# Altium schematic sheet 2_Battery_Monitoring_And_Switches.SchDoc: Batteries Monitor and Power Switches
size A3; DrawnBy: Sara V. Martínez; Engineer: Flight; DocumentNumber: 5; Revision: V0.1; SheetNumber: 5; SheetTotal: 11
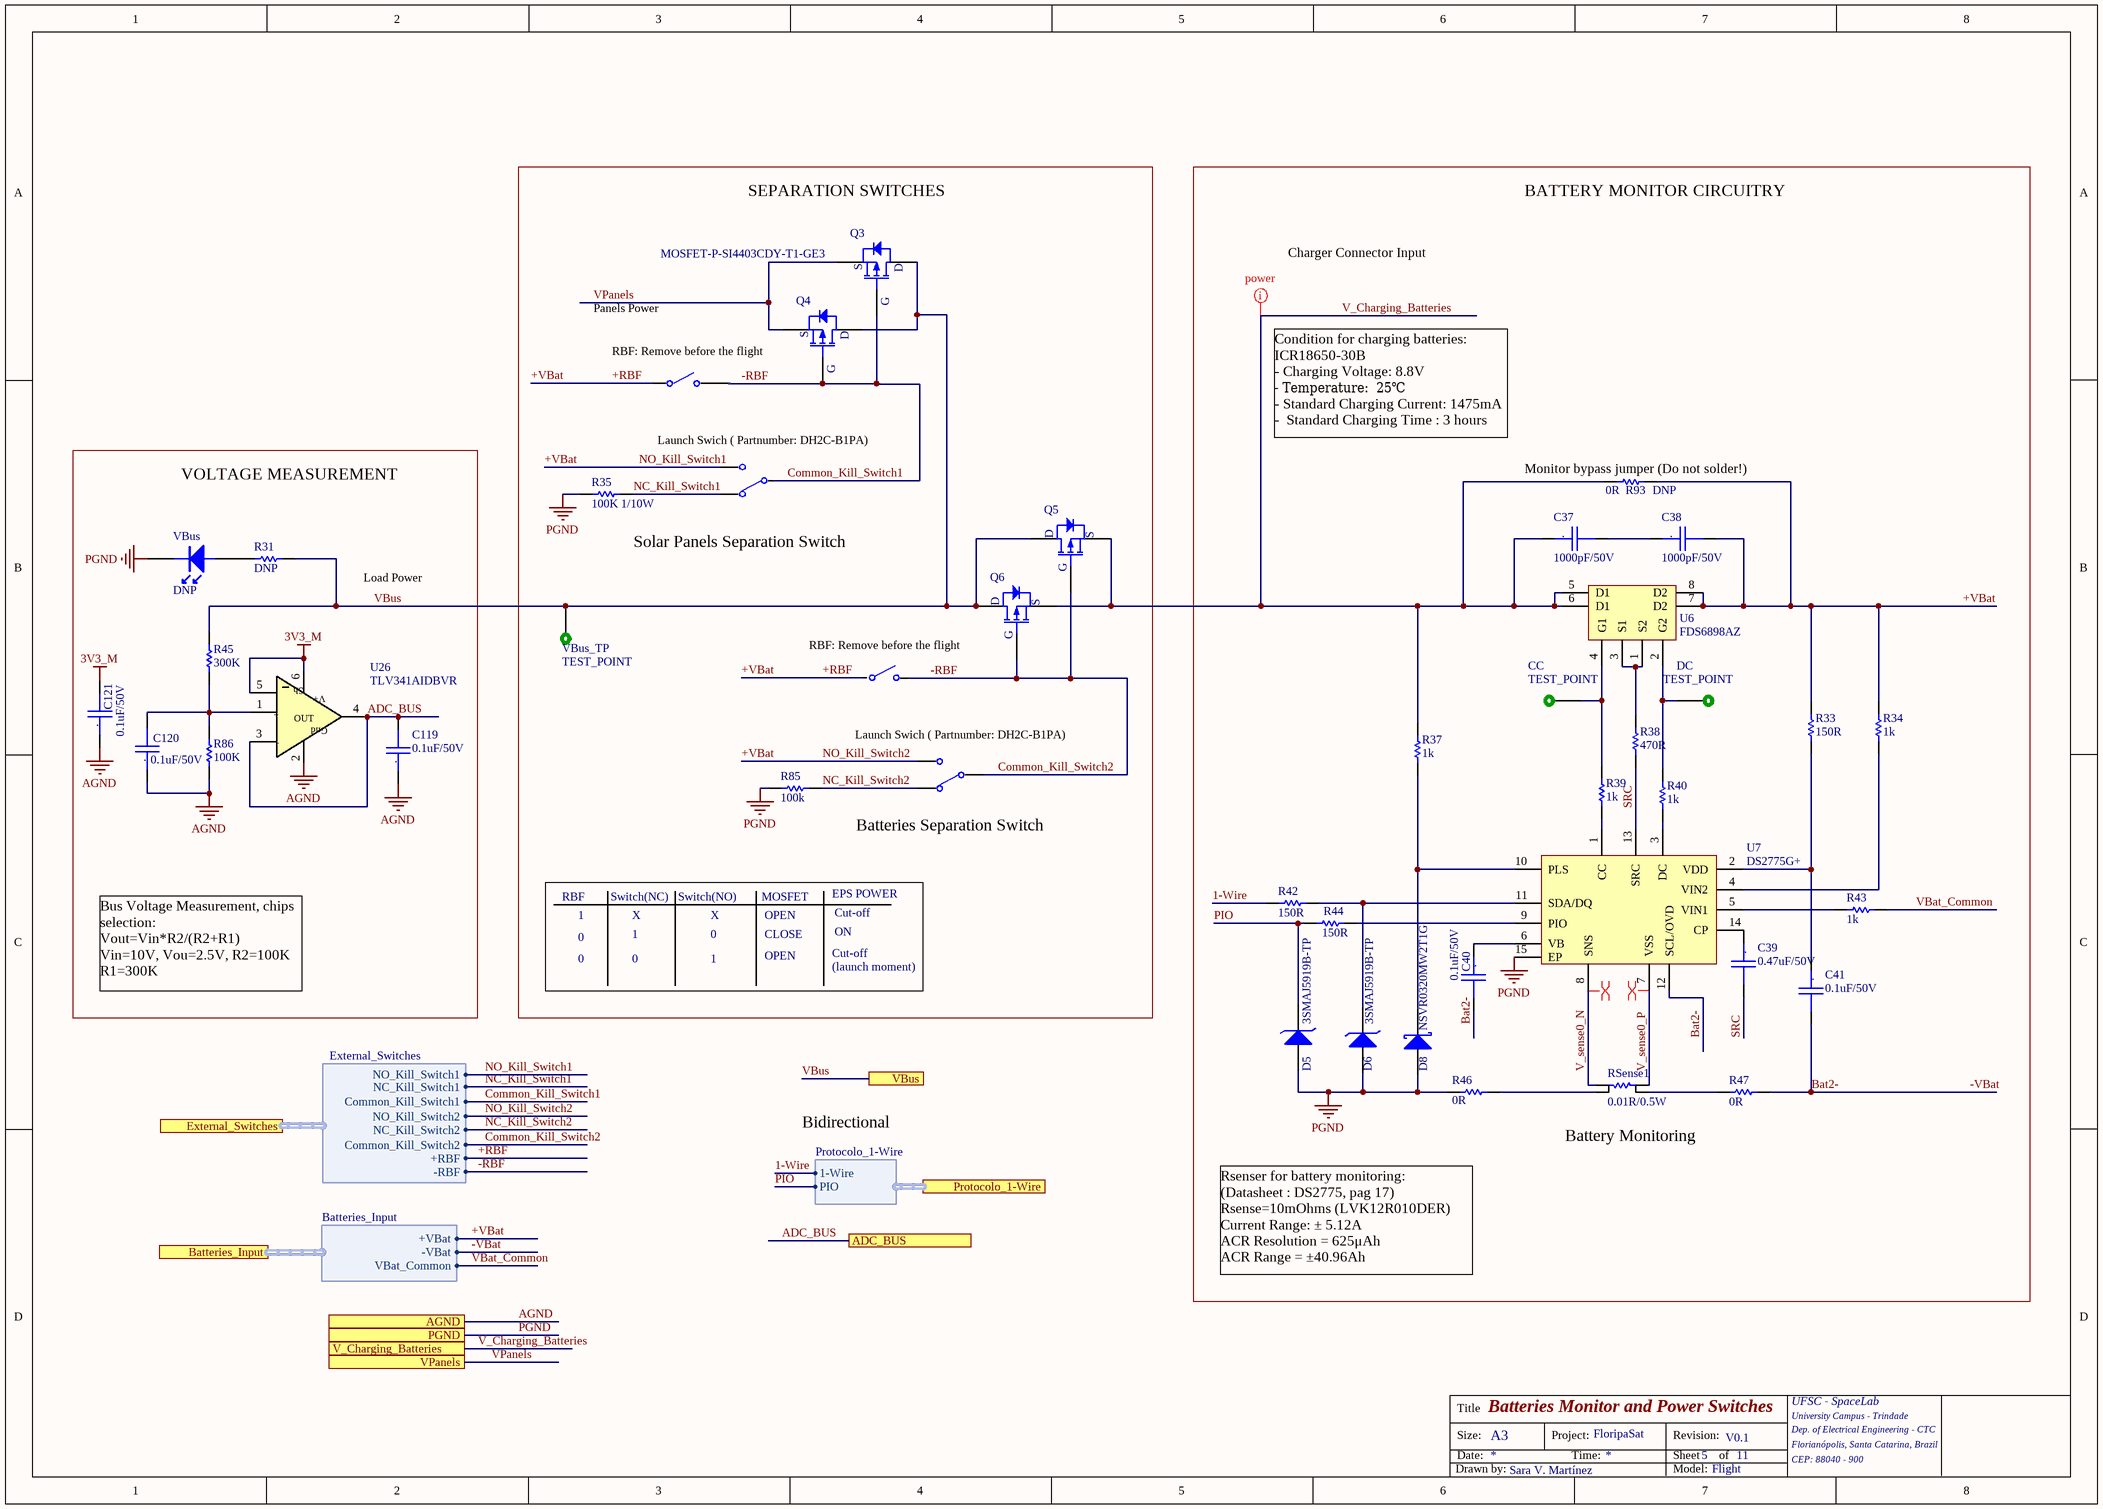
[diagram p0: 2_Battery_Monitoring_And_Switches.SchDoc]

## Parts
C37  1000pF/50V  [CC0603]
C38  1000pF/50V  [CC0603]
C39  0.47uF/50V  [CC0603]
C40  0.1uF/50V  [CC0603]
C41  0.1uF/50V  [CC0603]
C119  0.1uF/50V  [CC0603]
C120  0.1uF/50V  [CC0603]
C121  0.1uF/50V  [CC0603]
CC  TEST_POINT  [TEST_POINT]  (no BOM)
D5  3SMAJ5919B-TP  [DO-214AC]
D6  3SMAJ5919B-TP  [DO-214AC]
D8  NSVR0320MW2T1G  [SOD323F]
DC  TEST_POINT  [TEST_POINT]  (no BOM)
Q3  MOSFET-P-SI4403CDY-T1-GE3  [SOIC8_Mosfet]  (value not drawn)
Q4  MOSFET-P-SI4403CDY-T1-GE3  [SOIC8_Mosfet]
Q5  MOSFET-P-SI4403CDY-T1-GE3  [SOIC8_Mosfet]  (value not drawn)
Q6  MOSFET-P-SI4403CDY-T1-GE3  [SOIC8_Mosfet]  (value not drawn)
R31  DNP  [0603]
R33  150R  [0603]
R34  1k  [0603]
R35  100K 1/10W  [0805]
R37  1k  [0603]
R38  470R  [0603]
R39  1k  [0603]
R40  1k  [0603]
R42  150R  [0603]
R43  1k  [0603]
R44  150R  [0603]
R45  300K  [0603]
R46  0R  [1206]
R47  0R  [1206]
R85  100k  [0805]
R86  100K  [0603]
R93  0R  [1206]
RSense1  0.01R/0.5W  [1206 - ohmite]
U6  FDS6898AZ  [SOIC8]
U7  DS2775G+  [TDFN-14-EP_3x5]
U26  TLV341AIDBVR  [SOT-23 6L]
VBus  DNP  [0603-LED]
VBus_TP  TEST_POINT  [TEST_POINT]  (no BOM)

## Blocks framed on the sheet
VOLTAGE MEASUREMENT: C119-C121 R31 R45 R86 U26 VBus

## Ports
ADC_BUS, AGND, Batteries_Input (harness Batteries_Input), External_Switches (harness External_Switches), PGND, Protocolo_1-Wire (harness Protocolo_1-Wire), V_Charging_Batteries, VBus, VPanels

## Harnesses
Protocolo_1-Wire: 1-Wire, PIO
External_Switches: NO_Kill_Switch1, NC_Kill_Switch1, NO_Kill_Switch2, NC_Kill_Switch2, +RBF, -RBF, Common_Kill_Switch1, Common_Kill_Switch2
Batteries_Input: +VBat, -VBat, VBat_Common

## Nets
3V3_M: C121.2 U26.5(EN) U26.6(V+)
AGND: C119.1 C120.1 C121.1 R86.1 U26.2(Gnd) ; port AGND
PGND: D5.2(A) D6.2(A) D8.2(A) R35.1 R46.2 R85.1 U7.15(EP) VBus.2(K) ; port PGND
1-Wire: R42.2 ; port Protocolo_1-Wire.1-Wire
+RBF: C38.2 R33.1 R34.2 R93.2 U6.7(D2) U6.8(D2) ; port External_Switches.NO_Kill_Switch1, port External_Switches.NO_Kill_Switch2, port External_Switches.+RBF, port Batteries_Input.+VBat  [also labelled +VBat, NO_Kill_Switch1, NO_Kill_Switch2]
-RBF: Q3.2(G) Q4.2(G) Q5.2(G) Q6.2(G) ; port External_Switches.-RBF, port External_Switches.Common_Kill_Switch1, port External_Switches.Common_Kill_Switch2  [also labelled Common_Kill_Switch1, Common_Kill_Switch2]
-VBat: C40.2 C41.2 R47.1 U7.12(SCL/OVD) ; port Batteries_Input.-VBat  [also labelled Bat2-]
ADC_BUS: C119.2 U26.3(-IN) U26.4(OUT) ; port ADC_BUS
NC_Kill_Switch1: R35.2 ; port External_Switches.NC_Kill_Switch1
NC_Kill_Switch2: R85.2 ; port External_Switches.NC_Kill_Switch2
PIO: D5.1(K) R44.2 ; port Protocolo_1-Wire.PIO
SRC: C39.2 R38.1 U7.13(SRC)
V_Charging_Batteries: C37.1 Q5.1(S) Q6.1(S) R37.2 R93.1 U6.5(D1) U6.6(D1) ; port V_Charging_Batteries
V_sense0_N: RSense1.2 U7.8(SNS)
V_sense0_P: RSense1.1 U7.7(VSS)
VBat_Common: R43.1 ; port Batteries_Input.VBat_Common
VBus: Q3.3(D) Q4.3(D) Q5.3(D) Q6.3(D) R31.1 R45.2 VBus_TP.1 ; port VBus
VPanels: Q3.1(S) Q4.1(S) ; port VPanels
NetC37_2: C37.2 C38.1
NetC39_1: C39.1 U7.14(CP)
NetC40_1: C40.1 U7.6(VB)
NetC41_1: C41.1 R33.2 U7.2(VDD)
NetC120_2: C120.2 R45.1 R86.2 U26.1(+IN)
NetCC_1: CC.1 R39.2 U6.4(G1)
NetD6_1: D6.1(K) R42.1 U7.11(SDA/DQ)
NetD8_1: D8.1(K) R37.1 U7.10(PLS)
NetDC_1: DC.1 R40.2 U6.2(G2)
NetR31_2: R31.2 VBus.1(A)
NetR34_1: R34.1 U7.4(VIN2)
NetR38_2: R38.2 U6.1(S2) U6.3(S1)
NetR39_1: R39.1 U7.1(CC)
NetR40_1: R40.1 U7.3(DC)
NetR43_2: R43.2 U7.5(VIN1)
NetR44_1: R44.1 U7.9(PIO)
NetR46_1: R46.1 RSense1.4
NetR47_2: R47.2 RSense1.3

## Layout directives
differential pair: V_sense0_N, V_sense0_P
net class power: V_Charging_Batteries

## Notes on the sheet
- SEPARATION SWITCHES
- BATTERY MONITOR CIRCUITRY
- Panels Power
- Charger Connector Input
- (near Q4) RBF: Remove before the flight
- Launch Swich ( Partnumber: DH2C-B1PA)
- Condition for charging batteries:  ICR18650-30B
  - Charging Voltage: 8.8V
  - Temperature:  25℃
  - Standard Charging Current: 1475mA
  -  Standard Charging Time : 3 hours
- (near R93) Monitor bypass jumper (Do not solder!)
- (near R93) DNP
- Load Power
- (near R35) Solar Panels Separation Switch
- (near Q6) RBF: Remove before the flight
- Batteries Separation Switch
- RBF
- 1
- Switch(NC)
- X
- Switch(NO)
- MOSFET
- OPEN
- EPS POWER
- Cut-off
- Bus Voltage Measurement, chips selection:
  Vout=Vin*R2/(R2+R1)
  Vin=10V, Vou=2.5V, R2=100K
  R1=300K
- 0
- CLOSE
- (launch moment)
- ON
- Bidirectional
- Battery Monitoring
- Rsenser for battery monitoring:
  (Datasheet : DS2775, pag 17)
  Rsense=10mOhms (LVK12R010DER)
  Current Range: ± 5.12A
  ACR Resolution = 625μAh
  ACR Range = ±40.96Ah
- Title
- Size:
- Date:
- A3
- Project:
- Time:
- FloripaSat
- Revision:
- Sheet
- of
- UFSC - SpaceLab
- University Campus - Trindade
- Dep. of Electrical Engineering - CTC
- Florianópolis, Santa Catarina, Brazil
- CEP: 88040 - 900
- Drawn by:
- Model:
- (in symbol Cap_Cer_X7R_0.1uF_50V_0603) .
- (in symbol Cap_Cer_X7R_0.47uF_50V_0603) .
- (in symbol Cap_Cer_X7R_1000pF_50V_0603) .
- (in symbol TLV341AIDBVR) Sh; +; -

## Library data of the parts
C37 C38 = Cap_Cer_X7R_1000pF_50V_0603: CAP CER 1000pF 50V 10% X7R 0603; Partnumber: GRM188R71H102KA01D; NCM: 8532.24.10
C39 = Cap_Cer_X7R_0.47uF_50V_0603: CAP CER 0.47UF 50V 10% X7R 0603; Partnumber: C1608X7R1H474K080AE; NCM: 8532.24.10
C40 C41 C119-C121 = Cap_Cer_X7R_0.1uF_50V_0603: CAP CER 0.1UF 50V 10% X7R 0603; Partnumber: GRM188R71H104KA93D; NCM: 8532.24.10
CC DC VBus_TP = TEST_POINT: Test point
D5 D6 = DIODE_ZENER_5.6V_3SMAJ5919B: DIODE ZENER 5.6V 3W DO214AC; Partnumber: 3SMAJ5919B-TP; NCM: 8541.10.29
D8 = DIODE_SCHOTTKY_23V_1A_NSVR0320MW2T1G: DIODE SCHOTTKY 23V 1A SOD323F; NCM: 8541.10.29; Partnumber: NSVR0320MW2T1G
Q3-Q6 = MOSFET-P- SI4403CDY-T1-GE3: MOSFET 1.8V P-Channel 20 V, 0.0155 Ω typ., 13.4 A; Published: 8-Jun-2000; LatestRevisionDate: 17-Jul-2002; LatestRevisionNote: Re-released for DXP Platform.; PackageVersion: 1995/1996; PackageReference: E3; Publisher: Altium Limited; PackageDescription: TO, Flat Index; 3 In-Line, Axial Leads; Body Dia. 4.6mm; Lead Dia. 0.5 mm (max); Partnumber: SI4403CDY-T1-GE3
R31 R34 R37 R39 R40 R43 = R1.0k_1%_1/8W_0603: RES 1.0K OHM 1/8W 1% 0603; Partnumber: MCT06030C1001FP500; NCM: 8533.21.20
R33 R42 R44 = R150R_1%_1/8W_0603: RES 150R OHM 1/8W 1% 0603; Partnumber: CRCW0603150RFKEA; NCM: 8533.21.20
R35 = R100R_0.1%_1/10W_0805: RES 100K OHM 1/10W 0.1% 0805; Partnumber: CPF-A-0805B100KE; NCM: 8533.21.20
R38 = R470R_1%_1/8W_0603: RES 470R OHM 1/8W 1% 0603; Partnumber: MCT06030C4700FP500; NCM: 8533.21.20
R45 = R300K_0.1%_1/10W_0603: RES 300K OHM 1/10W 0.1% 0603; Partnumber: RG1608P-304-B-T5; NCM: 8533.21.20
R46 R47 R93 = R0R_JUMPER_1/2W_1206: RES 0.0 OHM 1/2W JUMP 1206; Partnumber: CRCW12060000Z0EAHP; NCM: 8533.21.20
R85 = R1.0k_1%_1/8W_0805: RES 100k OHM 1/8W 1% 0805; Partnumber: CPF-A-0805B100KE; NCM: 8533.21.20
R86 = R100K_1%_1/10W_0603: RES 100K OHM 1/10W 1% 0603; Partnumber: CRCW0603100KFKEA; NCM: 8533.21.20
RSense1 = R0.01R_0.5%_0.5W_1206_4_terminal: Current Sense Resistors - SMD 0.01ohm .5% 4 Terminal; Partnumber: LVK12R010DER; NCM: 8533.21.20
U6 = FDS6898AZ: MOSFET 2N-CH 20V 9.4A 8SOIC; Partnumber: FDS6898AZ
U7 = DS2775G+: IC FUEL GAUGE LI+ 2CELL 14-TDFN; Partnumber: DS2775G+
VBus = LED/G_0603: SMD Green LED; Partnumber: 150060VS75000; NCM: 8541.40.21
U26 = TLV341AIDBVR: Partnumber: TLV341AIDBVR